# EAGLE design NewMUM_route2 (EAGLE 7.1.0)
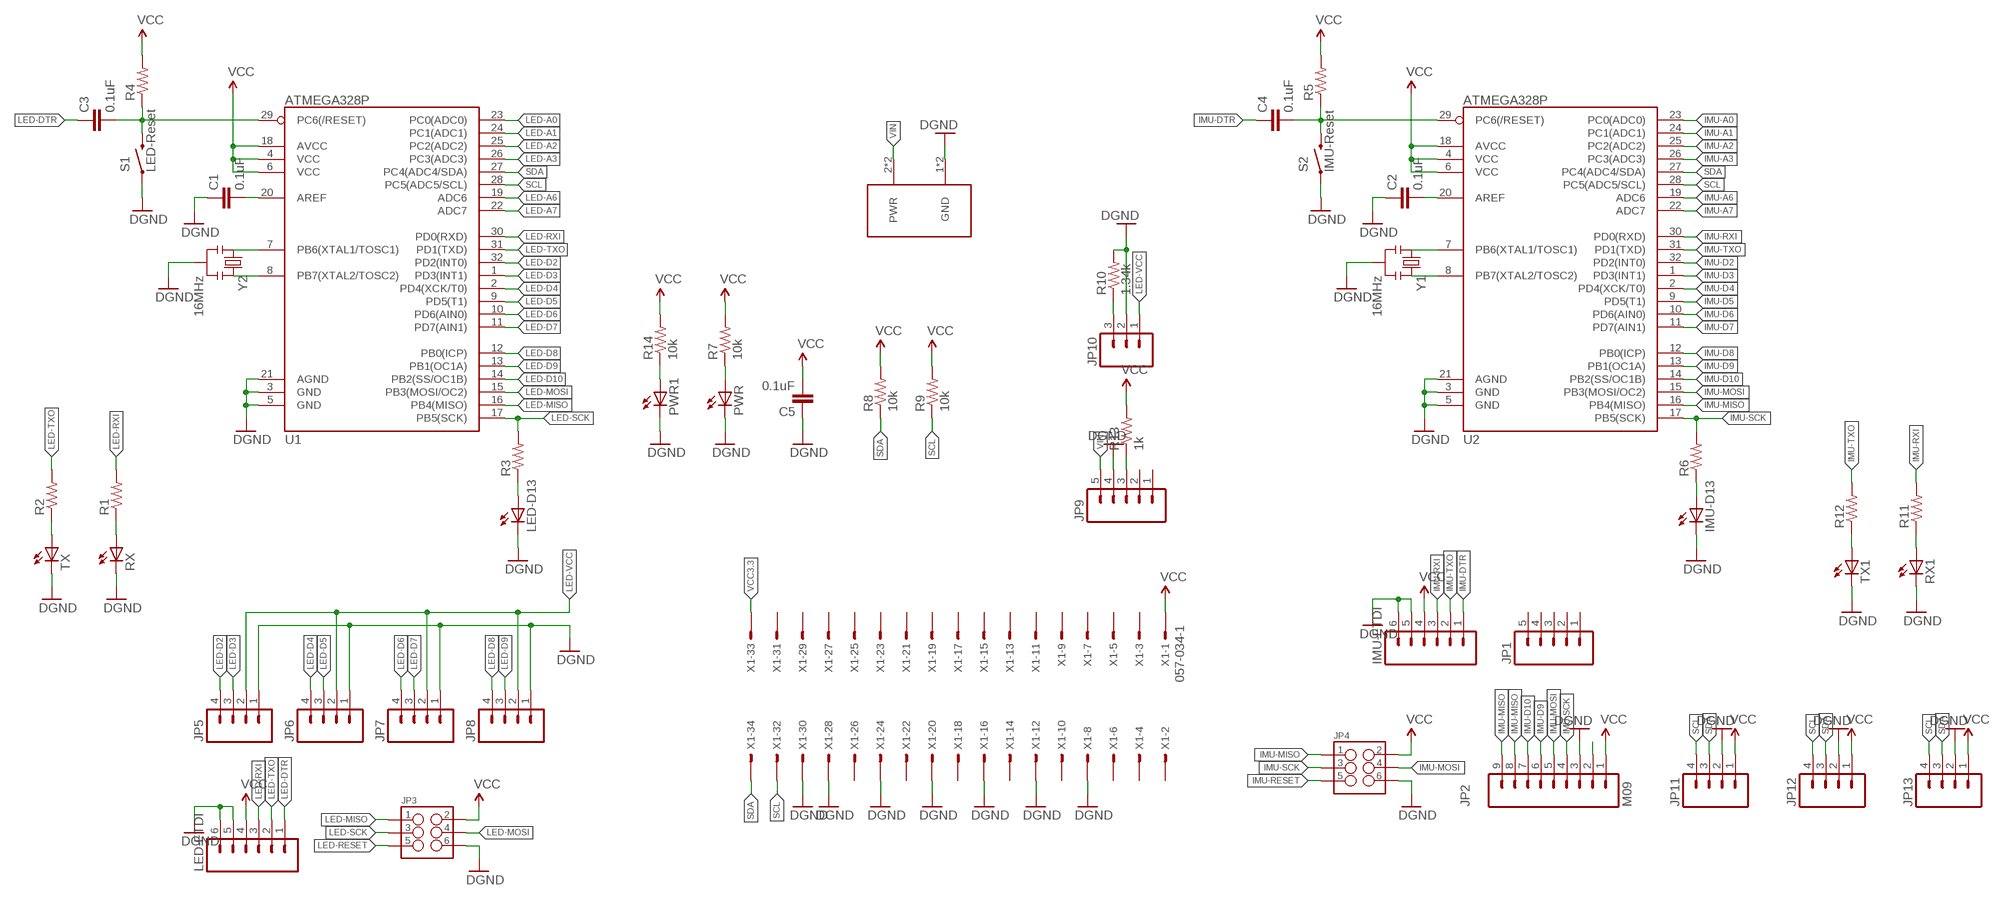
[diagram p0: schematic, sheet 1]

## Parts
C1  0.1uF  CAP0805  [0805]
C2  0.1uF  CAP0805  [0805]
C3  0.1uF  CAP0805  [0805]
C4  0.1uF  CAP0805  [0805]
C5  0.1uF  CAP0805  [0805]
IMU-D13  LED1206  [LED-1206]
IMU-FTDI  M06SIP  [1X06]
JP1  M05PTH  [1X05]
JP2  M09  [1X09]
JP3  M03X22X3_SILK_SM  [2X3]
JP4  M03X22X3_SILK_SM  [2X3]
JP5  M04PTH  [1X04]
JP6  M04PTH  [1X04]
JP7  M04PTH  [1X04]
JP8  M04PTH  [1X04]
JP9  M05PTH  [1X05]
JP10  M03PTH  [1X03]
JP11  M04PTH  [1X04]
JP12  M04PTH  [1X04]
JP13  M04PTH  [1X04]
LED-D13  LED1206  [LED-1206]
LED-FTDI  M06SIP  [1X06]
PWR  LED1206  [LED-1206]
PWR1  LED1206  [LED-1206]
R1  RESISTOR0805-RES  [0805]
R2  RESISTOR0805-RES  [0805]
R3  RESISTOR0805-RES  [0805]
R4  RESISTOR0805-RES  [0805]
R5  RESISTOR0805-RES  [0805]
R6  RESISTOR0805-RES  [0805]
R7  10k  RESISTOR0805-RES  [0805]
R8  10k  RESISTOR0805-RES  [0805]
R9  10k  RESISTOR0805-RES  [0805]
R10  1.34k  RESISTOREZ  [AXIAL-0.3EZ]
R11  RESISTOR0805-RES  [0805]
R12  RESISTOR0805-RES  [0805]
R13  1k  RESISTOR0805-RES  [0805]
R14  10k  RESISTOR0805-RES  [0805]
RX  LED1206  [LED-1206]
RX1  LED1206  [LED-1206]
S1  LED-Reset  SWITCH-MOMENTARY-2PTH  [TACTILE-PTH]
S2  IMU-Reset  SWITCH-MOMENTARY-2PTH  [TACTILE-PTH]
TX  LED1206  [LED-1206]
TX1  LED1206  [LED-1206]
U1  ATMEGA328P  ATMEGA328_SMT  [TQFP32-08]
U2  ATMEGA328P  ATMEGA328_SMT  [TQFP32-08]
U$3  LSF-SMT  [LSF-SMT]
X1  057-034-1  [057-034-1]
Y1  16MHz  RESONATOR16MHZ  [RESONATOR-SMD]
Y2  16MHz  RESONATOR16MHZ  [RESONATOR-SMD]

## Nets
GND: C1.1 C2.1 C5.1 IMU-D13.C IMU-FTDI.5 IMU-FTDI.6 JP2.3 JP3.6 JP4.6 JP5.1 JP6.1 JP7.1 JP8.1 JP9.4 JP10.2 JP11.2 JP12.2 JP13.2 LED-D13.C LED-FTDI.5 LED-FTDI.6 PWR1.C PWR.C R10.P$2 RX1.C RX.C S1.1 S2.1 TX1.C TX.C U1.3(GND) U1.5(GND) U1.21(AGND) U2.3(GND) U2.5(GND) U2.21(AGND) U$3.1(GND) U$3.1-2(GND) X1.8 X1.12 X1.16 X1.20 X1.24 X1.28 X1.30 Y1.2 Y2.2 ; supply symbol labelled DGND
IMU-A0: U2.23(PC0(ADC0))
IMU-A1: U2.24(PC1(ADC1))
IMU-A2: U2.25(PC2(ADC2))
IMU-A3: U2.26(PC3(ADC3))
IMU-A6: U2.19(ADC6)
IMU-A7: U2.22(ADC7)
IMU-D2: U2.32(PD2(INT0))
IMU-D3: U2.1(PD3(INT1))
IMU-D4: U2.2(PD4(XCK/T0))
IMU-D5: U2.9(PD5(T1))
IMU-D6: U2.10(PD6(AIN0))
IMU-D7: U2.11(PD7(AIN1))
IMU-D8: U2.12(PB0(ICP))
IMU-D9: JP2.6 U2.13(PB1(OC1A))
IMU-D10: JP2.7 U2.14(PB2(SS/OC1B))
IMU-DTR: C4.1 IMU-FTDI.1
IMU-MISO: JP2.8 JP2.9 JP4.1 U2.16(PB4(MISO))
IMU-MOSI: JP2.5 JP4.4 U2.15(PB3(MOSI/OC2))
IMU-RESET: C4.2 JP4.5 R5.1 S2.3 U2.29(PC6(/RESET))
IMU-RXI: IMU-FTDI.3 R11.2 U2.30(PD0(RXD))
IMU-SCK: JP2.4 JP4.3 R6.2 U2.17(PB5(SCK))
IMU-TXO: IMU-FTDI.2 R12.2 U2.31(PD1(TXD))
LED-A0: U1.23(PC0(ADC0))
LED-A1: U1.24(PC1(ADC1))
LED-A2: U1.25(PC2(ADC2))
LED-A3: U1.26(PC3(ADC3))
LED-A6: U1.19(ADC6)
LED-A7: U1.22(ADC7)
LED-D2: JP5.4 U1.32(PD2(INT0))
LED-D3: JP5.3 U1.1(PD3(INT1))
LED-D4: JP6.4 U1.2(PD4(XCK/T0))
LED-D5: JP6.3 U1.9(PD5(T1))
LED-D6: JP7.4 U1.10(PD6(AIN0))
LED-D7: JP7.3 U1.11(PD7(AIN1))
LED-D8: JP8.4 U1.12(PB0(ICP))
LED-D9: JP8.3 U1.13(PB1(OC1A))
LED-D10: U1.14(PB2(SS/OC1B))
LED-DTR: C3.1 LED-FTDI.1
LED-MISO: JP3.1 U1.16(PB4(MISO))
LED-MOSI: JP3.4 U1.15(PB3(MOSI/OC2))
LED-RESET: C3.2 JP3.5 R4.1 S1.3 U1.29(PC6(/RESET))
LED-RXI: LED-FTDI.3 R1.2 U1.30(PD0(RXD))
LED-SCK: JP3.3 R3.2 U1.17(PB5(SCK))
LED-TXO: LED-FTDI.2 R2.2 U1.31(PD1(TXD))
LED-VCC: JP5.2 JP6.2 JP7.2 JP8.2 JP10.1
N$1: U2.8(PB7(XTAL2/TOSC2)) Y1.3
N$2: U2.7(PB6(XTAL1/TOSC1)) Y1.1
N$3: U1.8(PB7(XTAL2/TOSC2)) Y2.3
N$4: U1.7(PB6(XTAL1/TOSC1)) Y2.1
N$5: R1.1 RX.A
N$6: C1.2 U1.20(AREF)
N$7: C2.2 U2.20(AREF)
N$8: R2.1 TX.A
N$9: LED-D13.A R3.1
N$10: R11.1 RX1.A
N$11: IMU-D13.A R6.1
N$12: R12.1 TX1.A
N$13: JP2.2
N$14: PWR.A R7.1
N$15: JP9.3 R13.1
N$16: PWR1.A R14.1
N$17: JP10.3 R10.P$1
SCL: JP11.4 JP12.4 JP13.4 R9.1 U1.28(PC5(ADC5/SCL)) U2.28(PC5(ADC5/SCL)) X1.32
SDA: JP11.3 JP12.3 JP13.3 R8.1 U1.27(PC4(ADC4/SDA)) U2.27(PC4(ADC4/SDA)) X1.34
VCC: C5.2 IMU-FTDI.4 JP2.1 JP3.2 JP4.2 JP11.1 JP12.1 JP13.1 LED-FTDI.4 R4.2 R5.2 R7.2 R8.2 R9.2 R13.2 R14.2 U1.4(VCC) U1.6(VCC) U1.18(AVCC) U2.4(VCC) U2.6(VCC) U2.18(AVCC) X1.1
VCC3.3: X1.33
VIN: JP9.5 U$3.2(PWR) U$3.2-2(PWR)
Unconnected: JP1.1 JP1.2 JP1.3 JP1.4 JP1.5 JP9.1 JP9.2 X1.2 X1.3 X1.4 X1.5 X1.6 X1.7 X1.9 X1.10 X1.11 X1.13 X1.14 X1.15 X1.17 X1.18 X1.19 X1.21 X1.22 X1.23 X1.25 X1.26 X1.27 X1.29 X1.31

## Library data of the parts
C1-C5 = SparkFun-Capacitors:CAP: Capacitor Standard 0603 ceramic capacitor, and 0.1" leaded capacitor.
IMU-D13 LED-D13 PWR PWR1 RX RX1 TX TX1 = LilyPad-Wearables:LED: LEDs Standard schematic elements and footprints for 5mm, 3mm, 1206, and 0603 sized LEDs. 5mm - Spark Fun Electronics SKU : Comp-SBL
IMU-FTDI LED-FTDI = SparkFun-Connectors:M06: Header 6 Standard 6-pin 0.1" header. Use with straight break away headers (SKU : PRT-00116), right angle break away headers (PRT-00553), swiss pins (PRT-00743), machine pins (PRT-00117), and female headers (PRT-00115). Molex polarized connector foot print use with SKU : PRT-08094 with associated crimp pins and housings. NOTES ON THE VARIANTS LOCK and LOCK_LONGPADS... This footprint was designed to help hold the alignment of a through-hole component (i.e. 6-pin header) while soldering it into place. You may notice that each hole has been shifted either up or down by 0.005 of an inch from it's more standard position (which is a perfectly straight line). This slight alteration caused the pins (the squares in the middle) to touch the edges of the holes. Because they are alternating, it causes a "brace" to hold the component in place. 0.005 has proven to be the perfect amount of "off-center" position when using our standard breakaway headers. Although looks a little odd when you look at the bare footprint, once you have a header in there, the alteration is very hard to notice. Also,if you push a header all the way into place, it is covered up entirely on the bottom side. This idea of altering the position of holes to aid alignment will be further integrated into the Sparkfun Library for other footprints. It can help hold any component with 3 or more connection pins.
JP1 JP9 = SparkFun-Connectors:M05: Header 5 Standard 5-pin 0.1" header. Use with straight break away headers (SKU : PRT-00116), right angle break away headers (PRT-00553), swiss pins (PRT-00743), machine pins (PRT-00117), and female headers (PRT-00115). Molex polarized connector foot print use with SKU : PRT-08230 with associated crimp pins and housings.
JP2 = SparkFun-Connectors:M09: Header 9 Standard 9-pin 0.1" header. Use with straight break away headers (SKU : PRT-00116), right angle break away headers (PRT-00553), swiss pins (PRT-00743), machine pins (PRT-00117), and female headers (PRT-00115).
JP3 JP4 = SparkFun-Connectors:M03X2: 2x3 .1" header. Shrouded, with keying- CONN-10681 SMT- CONN-11415 Pogo pins- HW-11044
JP5-JP8 JP11-JP13 = SparkFun-Connectors:M04: Header 4 Standard 4-pin 0.1" header. Use with straight break away headers (SKU : PRT-00116), right angle break away headers (PRT-00553), swiss pins (PRT-00743), machine pins (PRT-00117), and female headers (PRT-00115). Molex polarized connector foot print use with SKU : PRT-08231 with associated crimp pins and housings. 1MM SMD Version SKU: PRT-10208
JP10 = SparkFun-Connectors:M03: Header 3 Standard 3-pin 0.1" header. Use with straight break away headers (SKU : PRT-00116), right angle break away headers (PRT-00553), swiss pins (PRT-00743), machine pins (PRT-00117), and female headers (PRT-00115). Molex polarized connector foot print use with SKU : PRT-08232 with associated crimp pins and housings.
R1-R14 = SparkFun-Passives:RESISTOR: Resistor Basic schematic elements and footprints for 0603, 1206, and PTH resistors.
S1 S2 = SparkFun-Electromechanical:SWITCH-MOMENTARY-2: Various NO switches- pushbuttons, reed, etc
U1 U2 = SparkFun-DigitalIC:ATMEGA328_SMT: 32-Pin Atmega328 part Commonly used on Arduino compatible boards Available in QFP and QFN packages TQFP is IC-09069 QFN is non-stock; PROD_ID: IC-09069
U$3 = LSF-SMT:LSF-SMT
X1 = con-panduit:057-034-: CONNECTOR 34-pin series 057 contact pc board low profile headers; OC_FARNELL: unknown; OC_NEWARK: unknown
Y1 Y2 = SparkFun-FreqCtrl:RESONATOR: Resonator Small SMD resonator. Used, eg, on the Arduino Pro/ Pro Mini boards. 8MHz- XTAL-08895 16MHz- XTAL-08900; PROD_ID: XTAL-08900

## Board
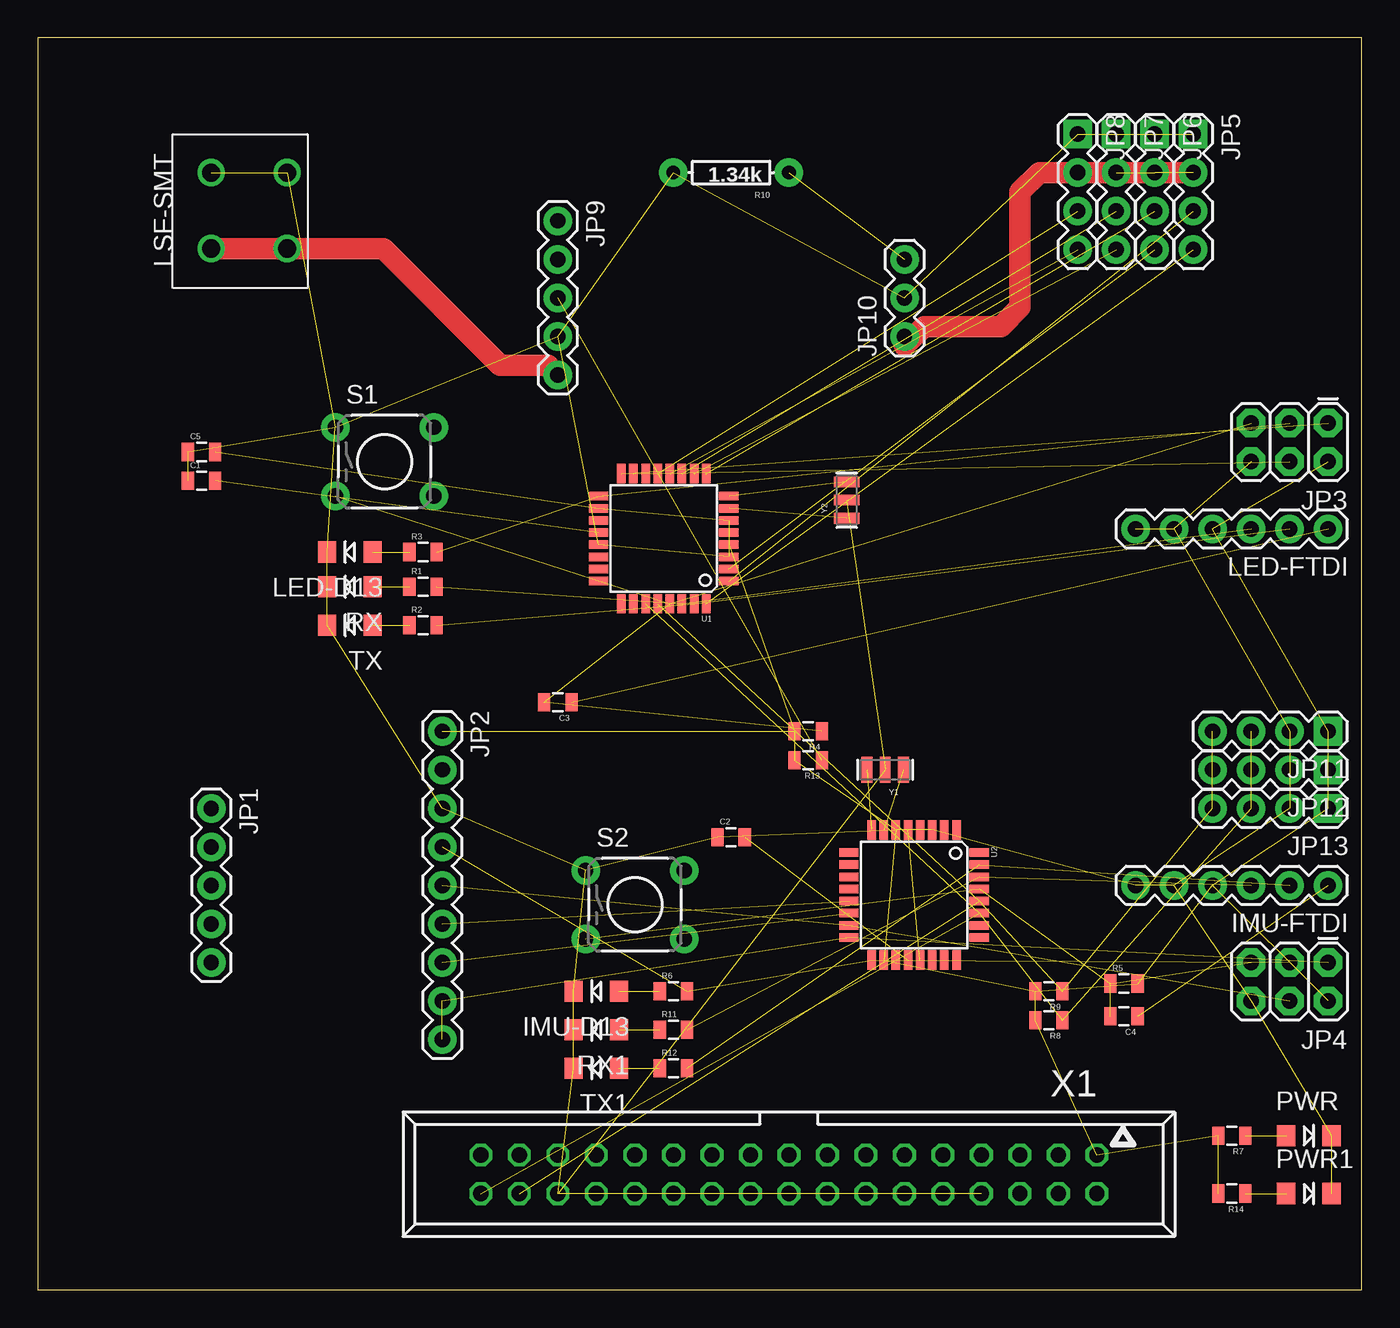
[diagram p1: board, top side]
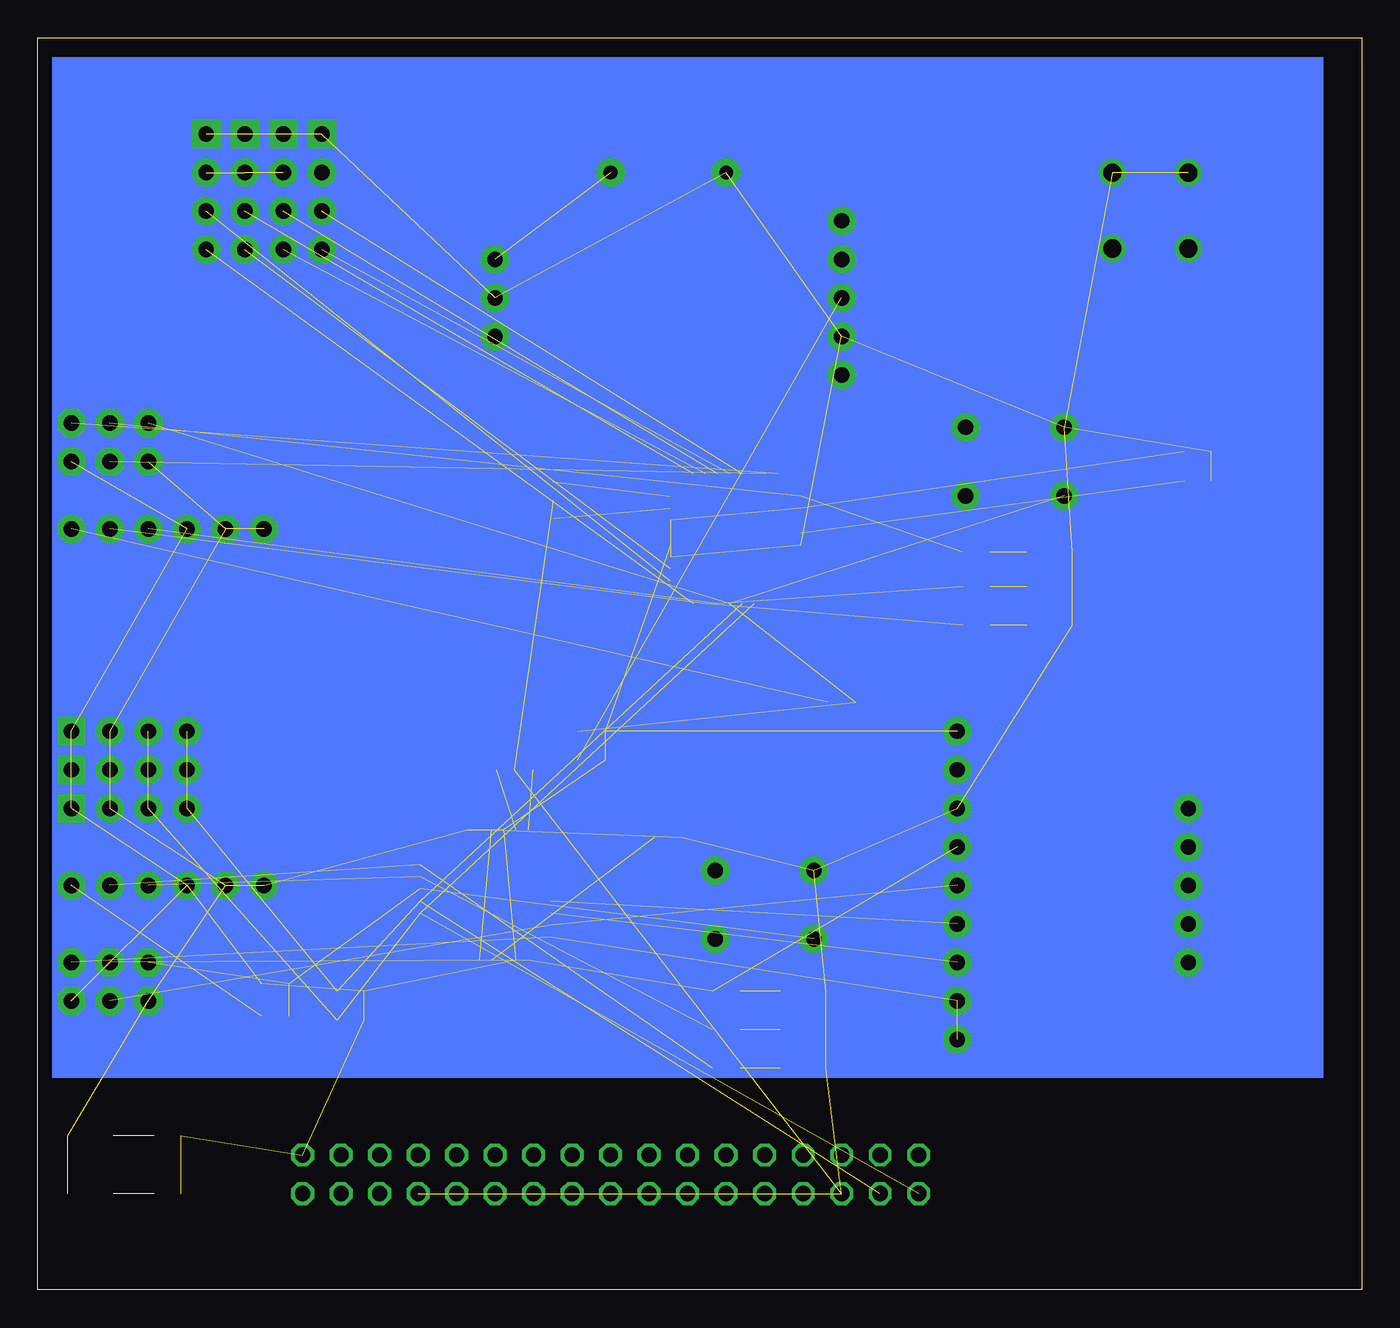
[diagram p2: board, bottom side, seen from below]

Size 87.3 x 82.54 mm. Coordinates in mm from the lower left corner, seen from the top.
Outline: 0,0 87.3,0 87.3,82.54 0,82.54 0,0
Copper layers (1*16): Top 0.035mm / dielectric 1.5mm / Bottom 0.035mm
Design rules "default": minimum track width 10mil, minimum drill 24mil, track to track 8mil, track to pad 8mil, pad to pad 8mil, via to via 8mil, smd to smd 8mil, copper to edge 40mil, drill to drill 8mil, minimum pad ring 10mil, minimum via ring 8mil, stop-mask expansion 4mil, vias tented up to drill 0mil, thermal gap 10mil

### Footprints (pad centres in the part's own frame; a part is rotated, then mirrored left to right if it is on the bottom)
0805 = smd 0.8 x 1.2: 1 -0.9,0; 2 0.9,0
LED-1206 = smd 1.2 x 1.4: A -1.5,0; C 1.5,0
1X06 = drill 1.016 pad 1.88: 1 0,0; 2 2.54,0; 3 5.08,0; 4 7.62,0; 5 10.16,0; 6 12.7,0
1X05 = drill 1.016 pad 1.88: 1 0,0; 2 2.54,0; 3 5.08,0; 4 7.62,0; 5 10.16,0
1X09 = drill 1.016 pad 1.88: 1 0,0; 2 2.54,0; 3 5.08,0; 4 7.62,0; 5 10.16,0; 6 12.7,0; 7 15.24,0; 8 17.78,0; 9 20.32,0
2X3 = drill 1.016 pad 1.88 octagon: 1 0,0; 2 0,2.54; 3 2.54,0; 4 2.54,2.54; 5 5.08,0; 6 5.08,2.54
1X04 = drill 1.016 pad 1.88 square: 1 0,0 | drill 1.016 pad 1.88: 2 2.54,0; 3 5.08,0; 4 7.62,0
1X03 = drill 1.016 pad 1.88: 1 0,0; 2 2.54,0; 3 5.08,0
AXIAL-0.3EZ = drill 0.9 pad 1.88: P$1 -3.81,0; P$2 3.81,0
TACTILE-PTH = drill 1.016 pad 1.88: 1 -3.251,2.261; 2 3.251,2.261; 3 -3.251,-2.261; 4 3.251,-2.261
TQFP32-08 = smd 1.27 x 0.559: 1 -4.293,2.8; 2 -4.293,2; 3 -4.293,1.2; 4 -4.293,0.4; 5 -4.293,-0.4; 6 -4.293,-1.2; 7 -4.293,-2; 8 -4.293,-2.8; 17 4.293,-2.8; 18 4.293,-2; 19 4.293,-1.2; 20 4.293,-0.4; 21 4.293,0.4; 22 4.293,1.2; 23 4.293,2; 24 4.293,2.8 | smd 0.559 x 1.27: 9 -2.8,-4.293; 10 -2,-4.293; 11 -1.2,-4.293; 12 -0.4,-4.293; 13 0.4,-4.293; 14 1.2,-4.293; 15 2,-4.293; 16 2.8,-4.293; 25 2.8,4.293; 26 2,4.293; 27 1.2,4.293; 28 0.4,4.293; 29 -0.4,4.293; 30 -1.2,4.293; 31 -2,4.293; 32 -2.8,4.293
LSF-SMT = drill 1.199: 1 0,5.004; 1-2 0,0; 2 5.004,5.004; 2-2 5.004,0
057-034-1 = drill 1 octagon: 1 -20.32,-1.27; 2 -20.32,1.27; 3 -17.78,-1.27; 4 -17.78,1.27; 5 -15.24,-1.27; 6 -15.24,1.27; 7 -12.7,-1.27; 8 -12.7,1.27; 9 -10.16,-1.27; 10 -10.16,1.27; 11 -7.62,-1.27; 12 -7.62,1.27; 13 -5.08,-1.27; 14 -5.08,1.27; 15 -2.54,-1.27; 16 -2.54,1.27; 17 0,-1.27; 18 0,1.27; 19 2.54,-1.27; 20 2.54,1.27; 21 5.08,-1.27; 22 5.08,1.27; 23 7.62,-1.27; 24 7.62,1.27; 25 10.16,-1.27; 26 10.16,1.27; 27 12.7,-1.27; 28 12.7,1.27; 29 15.24,-1.27; 30 15.24,1.27; 31 17.78,-1.27; 32 17.78,1.27; 33 20.32,-1.27; 34 20.32,1.27
RESONATOR-SMD = smd 0.7 x 1.7: 1 -1.2,0; 2 0,0; 3 1.2,0

### Placement (x,y rotation side)
C1  10.79,53.34 0 top
C2  45.72,29.84 0 top
C3  34.29,38.73 180 top
C4  71.63,18.03 180 top
C5  10.79,55.24 0 top
IMU-D13  36.83,19.68 180 top
IMU-FTDI  85.09,26.67 180 top
JP1  11.43,31.75 270 top
JP2  26.67,36.83 270 top
JP3  85.09,57.15 180 top
JP4  85.09,21.59 180 top
JP5  76.2,76.2 270 top
JP6  73.66,76.2 270 top
JP7  71.12,76.2 270 top
JP8  68.58,76.2 270 top
JP9  34.29,70.48 270 top
JP10  57.15,62.87 90 top
JP11  85.09,36.83 180 top
JP12  85.09,34.29 180 top
JP13  85.09,31.75 180 top
LED-D13  20.57,48.64 180 top
LED-FTDI  85.09,50.16 180 top
PWR  83.82,10.16 0 top
PWR1  83.82,6.35 0 top
R1  25.4,46.35 0 top
R2  25.4,43.81 0 top
R3  25.4,48.64 0 top
R4  50.8,36.83 180 top
R5  71.63,20.19 0 top
R6  41.91,19.68 0 top
R7  78.74,10.16 180 top
R8  66.67,17.78 180 top
R9  66.67,19.68 180 top
R10  45.72,73.66 180 top
R11  41.91,17.14 0 top
R12  41.91,14.61 0 top
R13  50.8,34.92 180 top
R14  78.74,6.35 180 top
RX  20.57,46.35 180 top
RX1  36.83,17.14 180 top
S1  22.86,54.61 0 top
S2  39.37,25.4 0 top
TX  20.57,43.81 180 top
TX1  36.83,14.61 180 top
U1  41.27,49.53 180 top
U2  57.78,26.04 270 top
U$3  11.43,73.66 270 top
X1  49.53,7.62 180 top
Y1  55.88,34.29 180 top
Y2  53.34,52.07 90 top

### Tracks (layer width: path | path; a pad name or v marks a point on that pad's centre or on a via)
GND  (46 unrouted)
IMU-D9  (1 unrouted)
IMU-D10  (1 unrouted)
IMU-DTR  (1 unrouted)
IMU-MISO  (3 unrouted)
IMU-MOSI  (2 unrouted)
IMU-RESET  (4 unrouted)
IMU-RXI  (2 unrouted)
IMU-SCK  (3 unrouted)
IMU-TXO  (2 unrouted)
LED-D2  (1 unrouted)
LED-D3  (1 unrouted)
LED-D4  (1 unrouted)
LED-D5  (1 unrouted)
LED-D6  (1 unrouted)
LED-D7  (1 unrouted)
LED-D8  (1 unrouted)
LED-D9  (1 unrouted)
LED-DTR  (1 unrouted)
LED-MISO  (1 unrouted)
LED-MOSI  (1 unrouted)
LED-RESET  (4 unrouted)
LED-RXI  (2 unrouted)
LED-SCK  (2 unrouted)
LED-TXO  (2 unrouted)
LED-VCC  (2 unrouted)
  Top 1.422: JP5.2 JP8.2 66.04,73.66 64.77,72.39 64.77,64.77 63.5,63.5 58.42,63.5 57.15,62.23 JP10.1
N$1  (1 unrouted)
N$2  (1 unrouted)
N$3  (1 unrouted)
N$4  (1 unrouted)
N$5  (1 unrouted)
N$6  (1 unrouted)
N$7  (1 unrouted)
N$8  (1 unrouted)
N$9  (1 unrouted)
N$10  (1 unrouted)
N$11  (1 unrouted)
N$12  (1 unrouted)
N$14  (1 unrouted)
N$15  (1 unrouted)
N$16  (1 unrouted)
N$17  (1 unrouted)
SCL  (6 unrouted)
SDA  (6 unrouted)
VCC  (22 unrouted)
VIN
  Top 1.422: U$3.2-2 U$3.2 22.78,68.66 30.48,60.96 33.66,60.96 JP9.5
(copper drawn outside any net)
  shapes: Bottom area x1